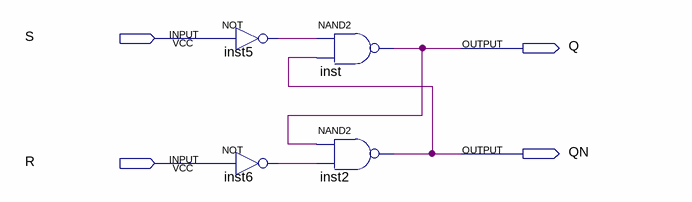
[diagram p0: schematic sheet]
// Quartus schematic lab9step1b.bdf as structural Verilog: 4 symbols, 4 pins
module lab9step1b (
  input  S,
  input  R,
  output Q,
  output QN
);

  wire inst5_out, inst6_out;

  not inst5 (inst5_out, S);
  not inst6 (inst6_out, R);
  nand inst (Q, inst5_out, QN);
  nand inst2 (QN, Q, inst6_out);
endmodule
